# Altium schematic sheet TopLevel.SchDoc
size A4
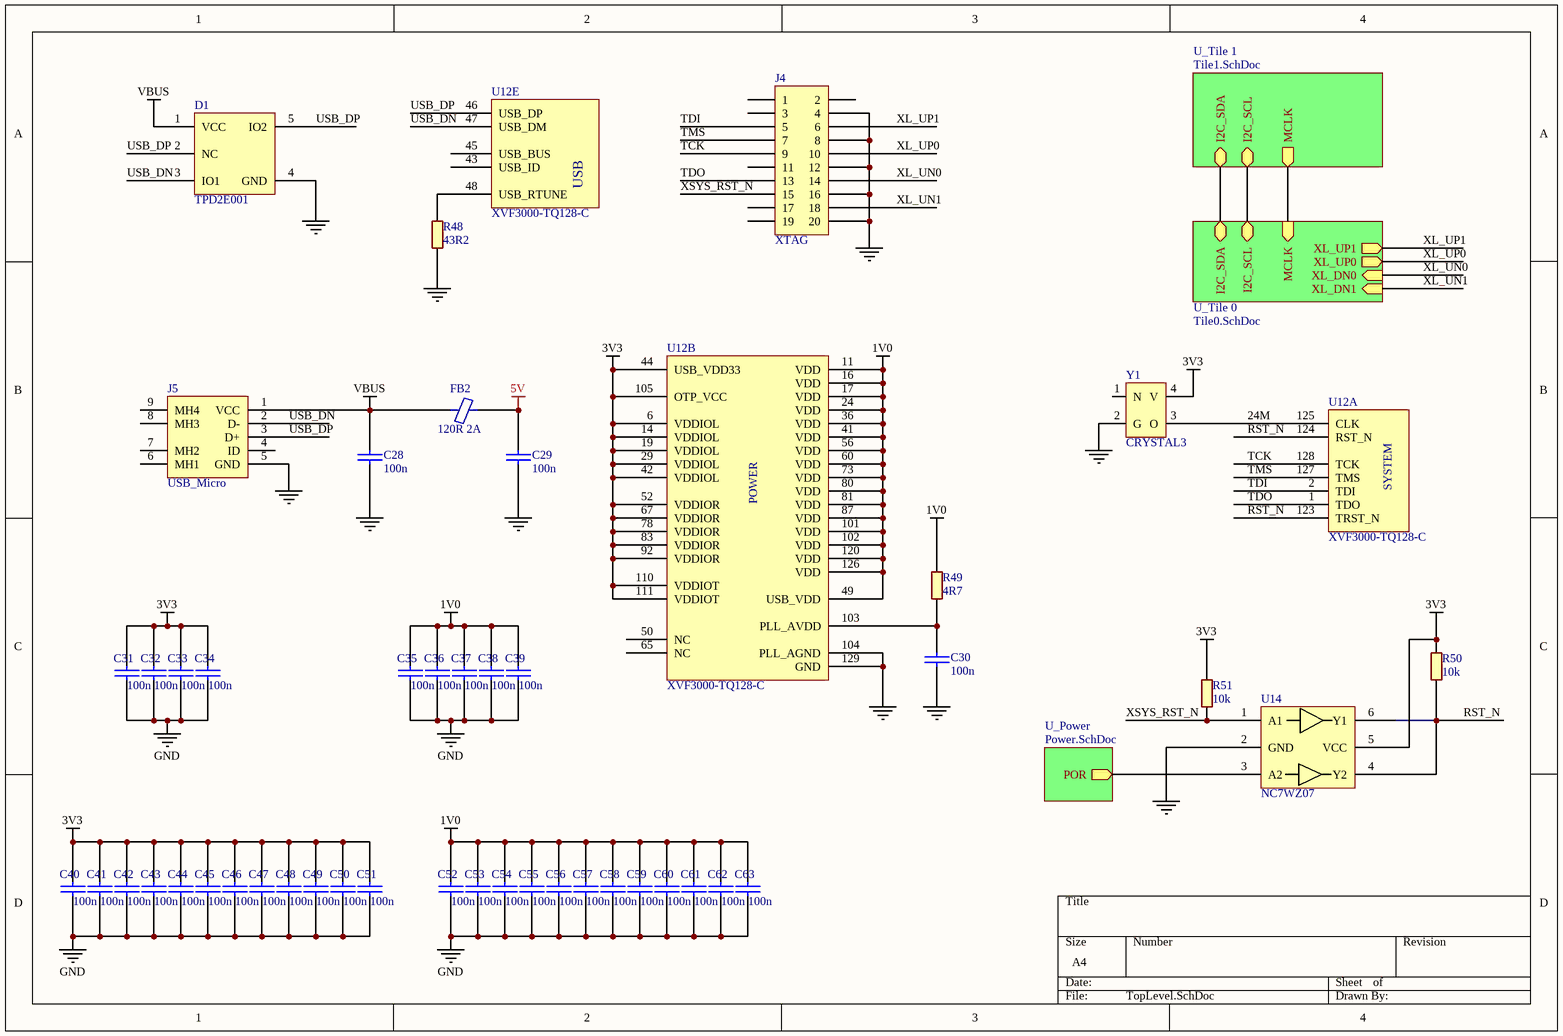
[diagram p0: TopLevel.SchDoc]

## Parts
C28  100n  [C0603]
C29  100n  [C0603]
C30  100n  [C0603]
C31  100n  [C0603]
C32  100n  [C0603]
C33  100n  [C0603]
C34  100n  [C0603]
C35  100n  [C0603]
C36  100n  [C0603]
C37  100n  [C0603]
C38  100n  [C0603]
C39  100n  [C0603]
C40  100n  [C0603]
C41  100n  [C0603]
C42  100n  [C0603]
C43  100n  [C0603]
C44  100n  [C0603]
C45  100n  [C0603]
C46  100n  [C0603]
C47  100n  [C0603]
C48  100n  [C0603]
C49  100n  [C0603]
C50  100n  [C0603]
C51  100n  [C0603]
C52  100n  [C0603]
C53  100n  [C0603]
C54  100n  [C0603]
C55  100n  [C0603]
C56  100n  [C0603]
C57  100n  [C0603]
C58  100n  [C0603]
C59  100n  [C0603]
C60  100n  [C0603]
C61  100n  [C0603]
C62  100n  [C0603]
C63  100n  [C0603]
D1  TPD2E001  [SOT-5X3]
FB2  120R 2A  [L0603]
J4  XTAG  [MHDR2X10]
J5  USB_Micro  [USB-MICRO5]
R48  43R2  [R0603]
R49  4R7  [R0603]
R50  10k  [R0603]
R51  10k  [R0603]
U12  XVF3000-TQ128-C  [LQFP-128 - VSS]  (parts A,B,E of 5)
U14  NC7WZ07  [SC70-6]
Y1  CRYSTAL3  [JT3225]

## Sub-sheets
U_Power = Power.SchDoc: POR (out)
U_Tile 0 = Tile0.SchDoc: I2C_SDA, I2C_SCL, XL_UP1 (out), XL_UP0 (out), XL_DN0 (in), XL_DN1 (in), MCLK (in)
U_Tile 1 = Tile1.SchDoc: I2C_SDA, I2C_SCL, MCLK (out)

## Nets
1V0: C35.1 C36.1 C37.1 C38.1 C39.1 C52.1 C53.1 C54.1 C55.1 C56.1 C57.1 C58.1 C59.1 C60.1 C61.1 C62.1 C63.1 R49.2 U12.11(VDD) U12.16(VDD) U12.17(VDD) U12.24(VDD) U12.36(VDD) U12.41(VDD) U12.49(USB_VDD) U12.56(VDD) U12.60(VDD) U12.73(VDD) U12.80(VDD) U12.81(VDD) U12.87(VDD) U12.101(VDD) U12.102(VDD) U12.120(VDD) U12.126(VDD)
3V3: C31.1 C32.1 C33.1 C34.1 C40.1 C41.1 C42.1 C43.1 C44.1 C45.1 C46.1 C47.1 C48.1 C49.1 C50.1 C51.1 R50.2 R51.2 U12.6(VDDIOL) U12.14(VDDIOL) U12.19(VDDIOL) U12.29(VDDIOL) U12.42(VDDIOL) U12.44(USB_VDD33) U12.52(VDDIOR) U12.67(VDDIOR) U12.78(VDDIOR) U12.83(VDDIOR) U12.92(VDDIOR) U12.105(OTP_VCC) U12.110(VDDIOT) U12.111(VDDIOT) U14.5(VCC) Y1.4(V)
5V: C29.1 FB2.2
GND: C28.2 C29.2 C30.2 C31.2 C32.2 C33.2 C34.2 C35.2 C36.2 C37.2 C38.2 C39.2 C40.2 C41.2 C42.2 C43.2 C44.2 C45.2 C46.2 C47.2 C48.2 C49.2 C50.2 C51.2 C52.2 C53.2 C54.2 C55.2 C56.2 C57.2 C58.2 C59.2 C60.2 C61.2 C62.2 C63.2 D1.4(GND) J4.4 J4.8 J4.12 J4.16 J4.20 J5.5(GND) R48.1 U12.104(PLL_AGND) U12.129(GND) U14.2(GND) Y1.2(G)
VBUS: C28.1 D1.1(VCC) FB2.1 J5.1(VCC)
24M: U12.125(CLK) Y1.3(O)
RST_N: R50.1 U12.123(TRST_N) U12.124(RST_N) U14.4(Y2) U14.6(Y1)
TCK: J4.9 U12.128(TCK)
TDI: J4.5 U12.2(TDI)
TDO: J4.13 U12.1(TDO)
TMS: J4.7 U12.127(TMS)
USB_DN: D1.3(IO1) J5.2(D-) U12.47(USB_DM)
USB_DP: D1.2(NC) D1.5(IO2) J5.3(D+) U12.46(USB_DP)
XL_UN0: J4.14 ; sheet U_Tile 0/XL_DN0
XL_UN1: J4.18 ; sheet U_Tile 0/XL_DN1
XL_UP0: J4.10 ; sheet U_Tile 0/XL_UP0
XL_UP1: J4.6 ; sheet U_Tile 0/XL_UP1
XSYS_RST_N: J4.15 R51.1 U14.1(A1)
NetC30_1: C30.1 R49.1 U12.103(PLL_AVDD)
NetR48_2: R48.2 U12.48(USB_RTUNE)
NetU14_3: U14.3(A2) ; sheet U_Power/POR
(unnamed): sheet U_Tile 1/I2C_SDA, sheet U_Tile 0/I2C_SDA
(unnamed): sheet U_Tile 1/I2C_SCL, sheet U_Tile 0/I2C_SCL
(unnamed): sheet U_Tile 1/MCLK, sheet U_Tile 0/MCLK

Not connected (* = marked no-connect by the designer): J4 1 2 3 11 17 19; J5 4(ID) 6(MH1) 7(MH2) 8(MH3) 9(MH4); U12 43(USB_ID) 45(USB_BUS) 50(NC) 65(NC); Y1 1(N)

## Notes on the sheet
- (in symbol XVF3000-TQ128-C, part A) SYSTEM
- (in symbol XVF3000-TQ128-C, part B) POWER
- (in symbol XVF3000-TQ128-C, part E) USB

## Library data of the parts
C28-C63 = CAP: Capacitor
FB2 = FB
J4 = MHDR2X10: Header, 10-Pin, Dual row; LatestRevisionDate: 17-Jul-2002; LatestRevisionNote: Re-released for DXP Platform.; Publisher: Altium Limited
J5 = USB_Micro_5S_B: USB micro female SMT with 4 fixed foot
R48-R51 = R: RES